# Altium project ActuatorBoard.PrjPcb
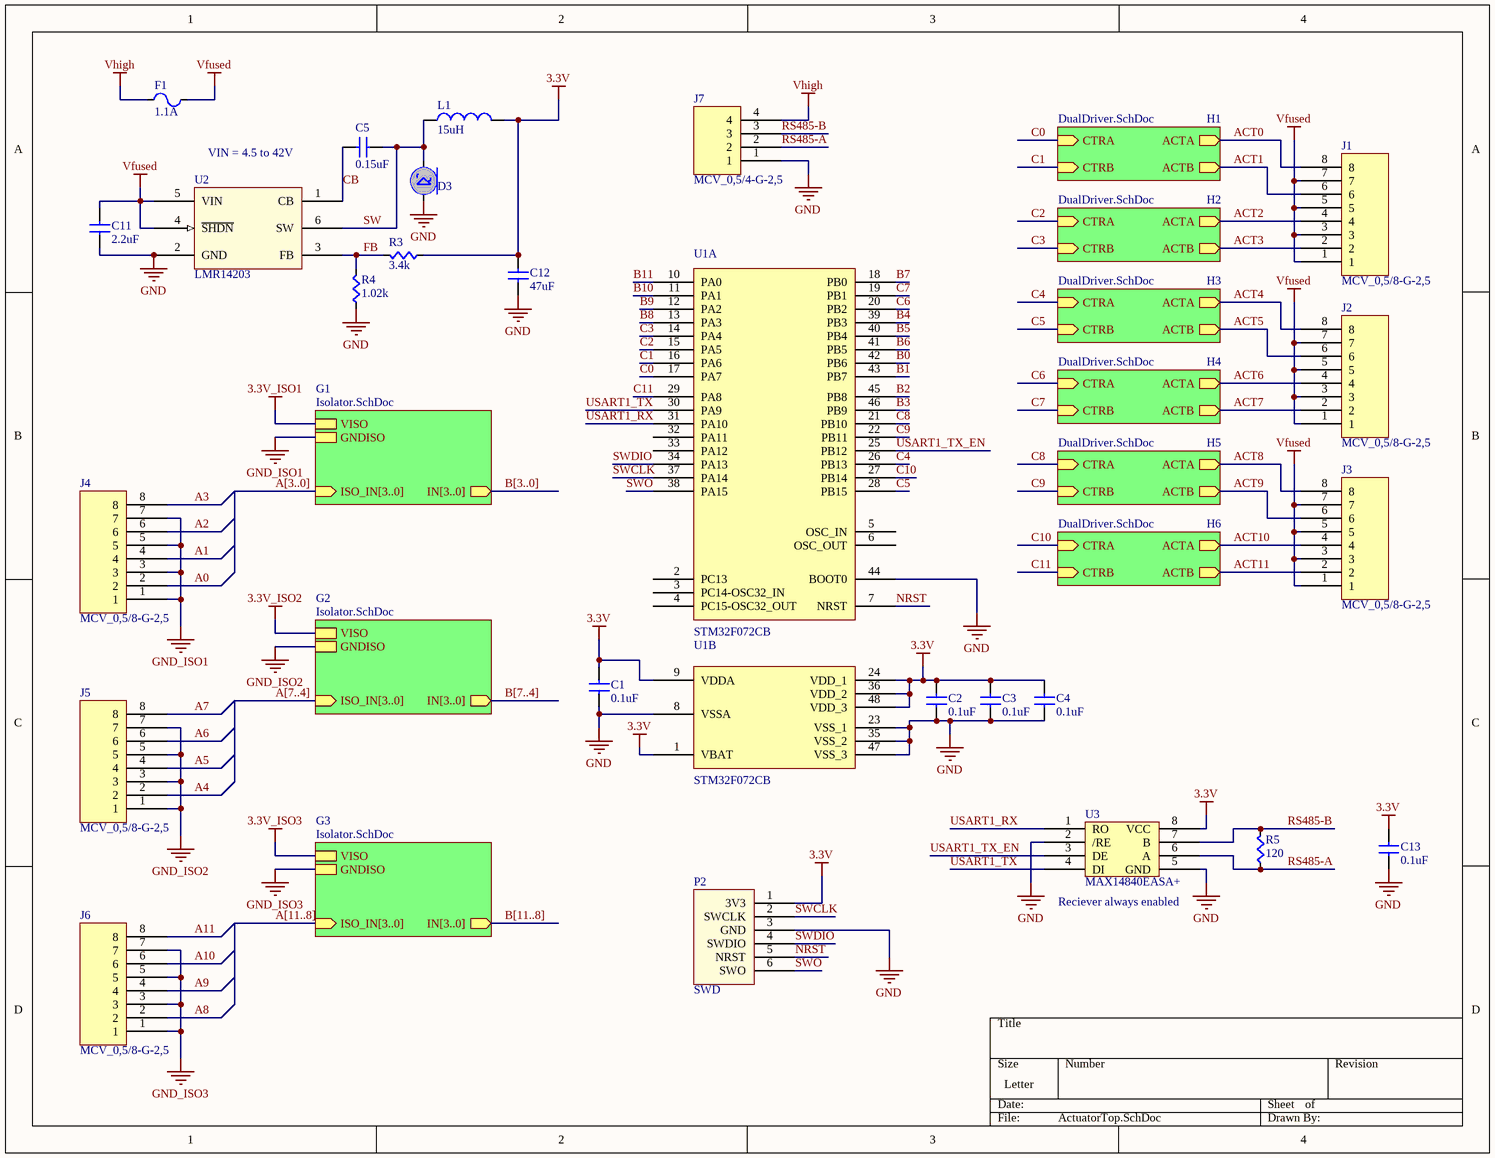
[diagram p0: ActuatorTop.SchDoc]
3 sheets, 85 parts. Net scope: hierarchical (ports join the sheet entries above them; power ports are global).
Board file: ActuatorBoard.PcbDoc
Sheets:
  ActuatorTop.SchDoc
    H1 = DualDriver.SchDoc
    H2 = DualDriver.SchDoc
    H3 = DualDriver.SchDoc
    H4 = DualDriver.SchDoc
    H5 = DualDriver.SchDoc
    H6 = DualDriver.SchDoc
    G1 = Isolator.SchDoc
    G2 = Isolator.SchDoc
    G3 = Isolator.SchDoc

## Sheet ActuatorTop.SchDoc
size Letter

### Parts
C1  value 0.1uF  [CAPC0603]  (hidden comment: Cap)
C2  value 0.1uF  [CAPC0603]  (hidden comment: Cap)
C3  value 0.1uF  [CAPC0603]  (hidden comment: Cap)
C4  value 0.1uF  [CAPC0603]  (hidden comment: Cap)
C5  value 0.15uF  [CAPC0603]  (hidden comment: Cap)
C11  value 2.2uF  [CAPC0805]  (hidden comment: Cap)
C12  value 47uF  [CAPC1206]  (hidden comment: Cap)
C13  value 0.1uF  [CAPC0603]  (hidden comment: Cap)
D3  Schottky  [1N5819HW-7-F]  (value not drawn)
F1  value 1.1A  [PTC7451X11N]  (hidden comment: PTC Fuse)
J1  MCV_0,5/8-G-2,5  [MCV_0,5/8-G-2,5]
J2  MCV_0,5/8-G-2,5  [MCV_0,5/8-G-2,5]
J3  MCV_0,5/8-G-2,5  [MCV_0,5/8-G-2,5]
J4  MCV_0,5/8-G-2,5  [MCV_0,5/8-G-2,5]
J5  MCV_0,5/8-G-2,5  [MCV_0,5/8-G-2,5]
J6  MCV_0,5/8-G-2,5  [MCV_0,5/8-G-2,5]
J7  MCV_0,5/4-G-2,5  [MCV_0,5/4-G-2,5]
L1  Inductance: 15uH  [INDP6060X48N]  (hidden comment: Inductor)
P2  SWD  [SWD_STM32]
R3  value 3.4k  [RES0603]  (hidden comment: Res)
R4  value 1.02k  [RES0603]  (hidden comment: Res)
R5  value 120  [RES0603]  (hidden comment: Res)
U1  STM32F072CB  [STM32F072CB]  (parts A,B of 2)
U2  LMR14203  [SOT95P280X110-6N]
U3  MAX14840EASA+  [MAX14840EASA+]

### Sub-sheets
G1 = Isolator.SchDoc: GNDISO, VISO, ISO_IN[3..0] (in), IN[3..0] (out)
G2 = Isolator.SchDoc: GNDISO, VISO, ISO_IN[3..0] (in), IN[3..0] (out)
G3 = Isolator.SchDoc: GNDISO, VISO, ISO_IN[3..0] (in), IN[3..0] (out)
H1 = DualDriver.SchDoc: ACTA (out), CTRA (in), ACTB (out), CTRB (in)
H2 = DualDriver.SchDoc: ACTA (out), CTRA (in), ACTB (out), CTRB (in)
H3 = DualDriver.SchDoc: ACTA (out), CTRA (in), ACTB (out), CTRB (in)
H4 = DualDriver.SchDoc: ACTA (out), CTRA (in), ACTB (out), CTRB (in)
H5 = DualDriver.SchDoc: ACTA (out), CTRA (in), ACTB (out), CTRB (in)
H6 = DualDriver.SchDoc: ACTA (out), CTRA (in), ACTB (out), CTRB (in)

### Nets
3.3V: C1.1(A) C2.1(A) C3.1(A) C4.1(A) C12.2(B) C13.1(A) L1.2(B) P2.1(3V3) R3.2(B) U1.1(VBAT) U1.9(VDDA) U1.24(VDD_1) U1.36(VDD_2) U1.48(VDD_3) U3.8(VCC)
GND: C1.2(B) C2.2(B) C3.2(B) C4.2(B) C11.1(A) C12.1(A) C13.2(B) D3.A J7.1 P2.3(GND) R4.2(B) U1.8(VSSA) U1.23(VSS_1) U1.35(VSS_2) U1.44(BOOT0) U1.47(VSS_3) U2.2(GND) U3.2(/RE) U3.5(GND)
GND_ISO1: J4.1 J4.3 J4.5 J4.7 ; sheet G1/GNDISO  [project net GNDISO]
GND_ISO2: J5.1 J5.3 J5.5 J5.7 ; sheet G2/GNDISO  [project net GNDISO]
GND_ISO3: J6.1 J6.3 J6.5 J6.7 ; sheet G3/GNDISO  [project net GNDISO]
Vfused: C11.2(B) F1.2(B) J1.1 J1.3 J1.5 J1.7 J2.1 J2.3 J2.5 J2.7 J3.1 J3.3 J3.5 J3.7 U2.4(~{SHDN}) U2.5(VIN)
Vhigh: F1.1(A) J7.4
A0: J4.2
A1: J4.4
A2: J4.6
A3: J4.8
A4: J5.2
A5: J5.4
A6: J5.6
A7: J5.8
A8: J6.2
A9: J6.4
A10: J6.6
A11: J6.8
ACT0: J1.8 ; sheet H1/ACTA
ACT1: J1.6 ; sheet H1/ACTB
ACT2: J1.4 ; sheet H2/ACTA
ACT3: J1.2 ; sheet H2/ACTB
ACT4: J2.8 ; sheet H3/ACTA
ACT5: J2.6 ; sheet H3/ACTB
ACT6: J2.4 ; sheet H4/ACTA
ACT7: J2.2 ; sheet H4/ACTB
ACT8: J3.8 ; sheet H5/ACTA
ACT9: J3.6 ; sheet H5/ACTB
ACT10: J3.4 ; sheet H6/ACTA
ACT11: J3.2 ; sheet H6/ACTB
B0: U1.42(PB6)
B1: U1.43(PB7)
B2: U1.45(PB8)
B3: U1.46(PB9)
B4: U1.39(PB3)
B5: U1.40(PB4)
B6: U1.41(PB5)
B7: U1.18(PB0)
B8: U1.13(PA3)
B9: U1.12(PA2)
B10: U1.11(PA1)
B11: U1.10(PA0)
C0: U1.17(PA7) ; sheet H1/CTRA
C1: U1.16(PA6) ; sheet H1/CTRB
C2: U1.15(PA5) ; sheet H2/CTRA
C3: U1.14(PA4) ; sheet H2/CTRB
C4: U1.26(PB13) ; sheet H3/CTRA
C5: U1.28(PB15) ; sheet H3/CTRB
C6: U1.20(PB2) ; sheet H4/CTRA
C7: U1.19(PB1) ; sheet H4/CTRB
C8: U1.21(PB10) ; sheet H5/CTRA
C9: U1.22(PB11) ; sheet H5/CTRB
C10: U1.27(PB14) ; sheet H6/CTRA
C11: U1.29(PA8) ; sheet H6/CTRB
CB: C5.1(A) U2.1(CB)
FB: R3.1(A) R4.1(A) U2.3(FB)
NRST: P2.5(NRST) U1.7(NRST)
RS485-A: J7.2 R5.2(B) U3.6(A)
RS485-B: J7.3 R5.1(A) U3.7(B)
SW: C5.2(B) D3.C L1.1(A) U2.6(SW)
SWCLK: P2.2(SWCLK) U1.37(PA14)
SWDIO: P2.4(SWDIO) U1.34(PA13)
SWO: P2.6(SWO) U1.38(PA15)
USART1_RX: U1.31(PA10) U3.1(RO)
USART1_TX: U1.30(PA9) U3.4(DI)
USART1_TX_EN: U1.25(PB12) U3.3(DE)

Not connected (* = marked no-connect by the designer): U1 2(PC13) 3(PC14-OSC32_IN) 4(PC15-OSC32_OUT) 5(OSC_IN) 6(OSC_OUT) 32(PA11) 33(PA12)

### Buses and harness runs
bus A[3..0] = sheet G1/ISO_IN[3..0]
bus A[7..4] = sheet G2/ISO_IN[3..0]
bus A[11..8] = sheet G3/ISO_IN[3..0]
bus B[3..0] = sheet G1/IN[3..0]
bus B[7..4] = sheet G2/IN[3..0]
bus B[11..8] = sheet G3/IN[3..0]

### Notes on the sheet
- VIN = 4.5 to 42V
- (near U3) Reciever always enabled

### Library data of the parts
D3 = Schottky: Schottky Diode Template; Supplier Part Number 1: 1N5819HW-FDICT-ND; Supplier 1: Digi-Key
F1 = PTC_Fuse: Supplier 1: Digi-Key; Supplier Part Number 1: 507-1744-1-ND
J1-J6 = MCV_0,5/8-G-2,5: CONN TERM BLOCK 2.50MM 8POS, Vertical, Through-Hole, 4A; Supplier 1: Digi-Key; Supplier Part Number 1: 277-1458-ND; Mating Conn. Digi-Key P/N: 277-1436-ND
J7 = MCV_0,5/4-G-2,5: CONN TERM BLOCK 2.50MM 4POS, Vertical, Through-Hole, 4A; Supplier 1: Digi-Key; Supplier Part Number 1: 277-1454-ND; Mating Conn. Digi-Key P/N: 277-1432-ND
P2 = SWD_STM32: SWD connector matching the pinout on STM Discovery Boards; Supplier 1: Digi-Key
U1 = STM32F072CB: MCU 32BIT 128KB FLASH 48LQFP; Supplier 1: Digi-Key; Supplier Part Number 1: 497-14645-ND
U2 = LMR14203: Simple Switcher 42Vin 0.3A Step-Down Voltage Regulator; Supplier 1: Digi-Key; Supplier Part Number 1: LMR14203XMKE/NOPBCT-ND
U3 = MAX14840EASA+: TXRX 40MBPS RS485/RS422 8-SOIC; Supplier 1: Digi-Key; Supplier Part Number 1: MAX14840EASA+-ND
C1-C5 C11-C13 = Cap: Supplier 1: Digi-Key
  C1-C4 C13: Supplier Part Number 1: 445-1314-1-ND
  C5: Supplier Part Number 1: 445-13339-1-ND
  C11: Supplier Part Number 1: 445-5968-1-ND
  C12: Supplier Part Number 1: 399-5508-1-ND
L1 = Inductor: Supplier 1: Digi-Key; Supplier Part Number 1: 445-4574-1-ND
R3-R5 = Res: Supplier 1: Digi-Key
  R3: Supplier Part Number 1: 311-3.40KHRCT-ND
  R4: Supplier Part Number 1: 311-1.02KHRCT-ND
  R5: Supplier Part Number 1: 311-120HRCT-ND

## Sheet DualDriver.SchDoc
size Letter
Used 6 times, as channels H1, H2, H3, H4, H5, H6. Parts and nets are listed once, with the designators drawn on the sheet.
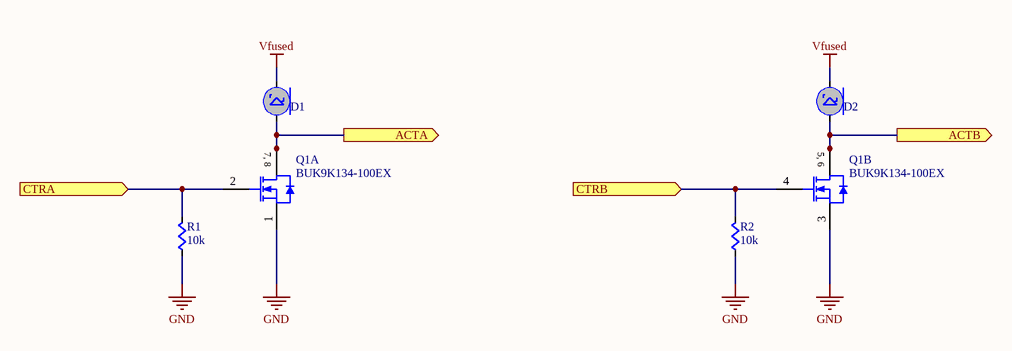
[diagram p1: DualDriver.SchDoc]

### Parts
D1  Schottky  [SS110-TP]  (value not drawn)
D2  Schottky  [SS110-TP]  (value not drawn)
Q1  BUK9K134-100EX  [NXP_SOT1205]  (parts A,B of 2)
R1  value 10k  [RES0603]  (hidden comment: Res)
R2  value 10k  [RES0603]  (hidden comment: Res)

### Ports
ACTA (out), ACTB (out), CTRA (in), CTRB (in)

### Nets
GND: Q1.1(S) Q1.3(S) R1.2(B) R2.2(B)
Vfused: D1.C D2.C
ACTA: D1.A Q1.7(D) Q1.8(D) ; port ACTA
ACTB: D2.A Q1.5(D) Q1.6(D) ; port ACTB
CTRA: Q1.2(G) R1.1(A) ; port CTRA
CTRB: Q1.4(G) R2.1(A) ; port CTRB

### Channels
H1: designators end in _H1; ports ACTA=ACT0 ACTB=ACT1 CTRA=C0 CTRB=C1
H2: designators end in _H2; ports ACTA=ACT2 ACTB=ACT3 CTRA=C2 CTRB=C3
H3: designators end in _H3; ports ACTA=ACT4 ACTB=ACT5 CTRA=C4 CTRB=C5
H4: designators end in _H4; ports ACTA=ACT6 ACTB=ACT7 CTRA=C6 CTRB=C7
H5: designators end in _H5; ports ACTA=ACT8 ACTB=ACT9 CTRA=C8 CTRB=C9
H6: designators end in _H6; ports ACTA=ACT10 ACTB=ACT11 CTRA=C10 CTRB=C11

### Notes on the sheet
- (in symbol BUK9K134-100EX, part A) 7, 8
- (in symbol BUK9K134-100EX, part B) 5, 6

### Library data of the parts
D1 D2 = Schottky: Schottky Diode Template; Supplier 1: Digi-Key; Supplier Part Number 1: B1100-FDICT-ND
Q1 = BUK9K134-100EX: MOSFET DUAL N-CH 100V 8.5A SOT1205; Supplier 1: Digi-Key; Supplier Part Number 1: 568-11631-1-ND
R1 R2 = Res: Supplier 1: Digi-Key; Supplier Part Number 1: 311-10.0KHRCT-ND

## Sheet Isolator.SchDoc
size A
Used 3 times, as channels G1, G2, G3. Parts and nets are listed once, with the designators drawn on the sheet.
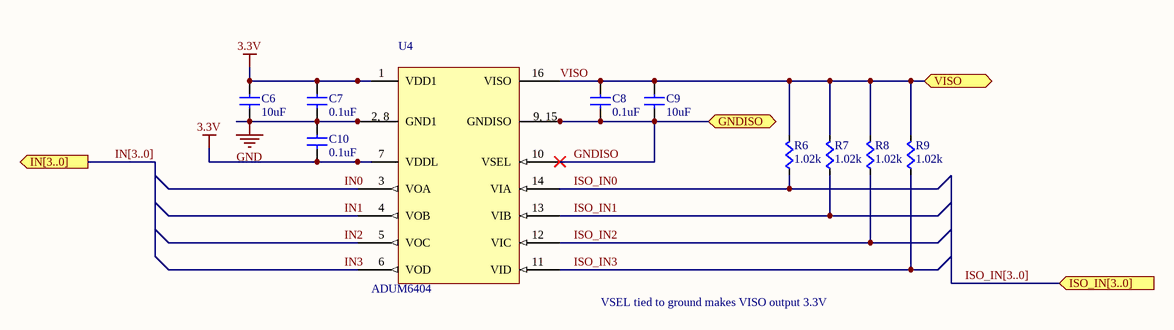
[diagram p2: Isolator.SchDoc]

### Parts
C6  value 10uF  [CAPC0603]  (hidden comment: Cap)
C7  value 0.1uF  [CAPC0603]  (hidden comment: Cap)
C8  value 0.1uF  [CAPC0603]  (hidden comment: Cap)
C9  value 10uF  [CAPC0603]  (hidden comment: Cap)
C10  value 0.1uF  [CAPC0603]  (hidden comment: Cap)
R6  value 1.02k  [RES0603]  (hidden comment: Res)
R7  value 1.02k  [RES0603]  (hidden comment: Res)
R8  value 1.02k  [RES0603]  (hidden comment: Res)
R9  value 1.02k  [RES0603]  (hidden comment: Res)
U4  ADUM6404  [SOIC127P1030X265-16N]

### Ports
GNDISO, IN[3..0] (out), ISO_IN[3..0] (in), VISO

### Nets
3.3V: C6.2(B) C7.2(B) C10.1(A) U4.1(VDD1) U4.7(VDDL)
GND: C6.1(A) C7.1(A) C10.2(B) U4.2(GND1) U4.8(GND1)
GNDISO: C8.1(A) C9.1(A) U4.9(GNDISO) U4.10(VSEL) U4.15(GNDISO) ; port GNDISO
IN0: U4.3(VOA)
IN1: U4.4(VOB)
IN2: U4.5(VOC)
IN3: U4.6(VOD)
ISO_IN0: R6.2(B) U4.14(VIA)
ISO_IN1: R7.2(B) U4.13(VIB)
ISO_IN2: R8.2(B) U4.12(VIC)
ISO_IN3: R9.2(B) U4.11(VID)
VISO: C8.2(B) C9.2(B) R6.1(A) R7.1(A) R8.1(A) R9.1(A) U4.16(VISO) ; port VISO

### Channels
G1: designators end in _G1; ports GNDISO=GNDISO VISO=VISO_G1
G2: designators end in _G2; ports GNDISO=GNDISO VISO=VISO_G2
G3: designators end in _G3; ports GNDISO=GNDISO VISO=VISO_G3

### Buses and harness runs
bus IN[3..0] = port IN[3..0]
bus ISO_IN[3..0] = port ISO_IN[3..0]

### Notes on the sheet
- VSEL tied to ground makes VISO output 3.3V
- (in symbol ADUM6404) 2, 8; 9, 15

### Library data of the parts
U4 = ADUM6404: Digital Isolator, 4 channel, with isolated power; Supplier 1: Digi-Key; Supplier Part Number 1: ADUM6404ARWZ-ND
C6-C10 = Cap: Supplier 1: Digi-Key
  C6 C9: Supplier Part Number 1: 445-4112-1-ND
  C7 C8 C10: Supplier Part Number 1: 445-1314-1-ND
R6-R9 = Res: Supplier 1: Digi-Key; Supplier Part Number 1: 311-1.02KHRCT-ND

## Nets that join several sheets
3.3V: ActuatorTop (15 pins), G1 (5 pins), G2 (5 pins), G3 (5 pins)
GND: ActuatorTop (19 pins), H1 (Q1_H1.1 Q1_H1.3 R1_H1.2 R2_H1.2), H2 (Q1_H2.1 Q1_H2.3 R1_H2.2 R2_H2.2), H3 (Q1_H3.1 Q1_H3.3 R1_H3.2 R2_H3.2), H4 (Q1_H4.1 Q1_H4.3 R1_H4.2 R2_H4.2), H5 (Q1_H5.1 Q1_H5.3 R1_H5.2 R2_H5.2), H6 (Q1_H6.1 Q1_H6.3 R1_H6.2 R2_H6.2), G1 (5 pins), G2 (5 pins), G3 (5 pins)
GNDISO: ActuatorTop (J4.1 J4.3 J4.5 J4.7), G1 (5 pins)
GNDISO: ActuatorTop (J5.1 J5.3 J5.5 J5.7), G2 (5 pins)
GNDISO: ActuatorTop (J6.1 J6.3 J6.5 J6.7), G3 (5 pins)
Vfused: ActuatorTop (16 pins), H1 (D1_H1.C D2_H1.C), H2 (D1_H2.C D2_H2.C), H3 (D1_H3.C D2_H3.C), H4 (D1_H4.C D2_H4.C), H5 (D1_H5.C D2_H5.C), H6 (D1_H6.C D2_H6.C)
A0: ActuatorTop (J4.2), G1 (R6_G1.2 U4_G1.14)
A1: ActuatorTop (J4.4), G1 (R7_G1.2 U4_G1.13)
A2: ActuatorTop (J4.6), G1 (R8_G1.2 U4_G1.12)
A3: ActuatorTop (J4.8), G1 (R9_G1.2 U4_G1.11)
A4: ActuatorTop (J5.2), G2 (R6_G2.2 U4_G2.14)
A5: ActuatorTop (J5.4), G2 (R7_G2.2 U4_G2.13)
A6: ActuatorTop (J5.6), G2 (R8_G2.2 U4_G2.12)
A7: ActuatorTop (J5.8), G2 (R9_G2.2 U4_G2.11)
A8: ActuatorTop (J6.2), G3 (R6_G3.2 U4_G3.14)
A9: ActuatorTop (J6.4), G3 (R7_G3.2 U4_G3.13)
A10: ActuatorTop (J6.6), G3 (R8_G3.2 U4_G3.12)
A11: ActuatorTop (J6.8), G3 (R9_G3.2 U4_G3.11)
ACT0: ActuatorTop (J1.8), H1 (D1_H1.A Q1_H1.7 Q1_H1.8)
ACT1: ActuatorTop (J1.6), H1 (D2_H1.A Q1_H1.5 Q1_H1.6)
ACT2: ActuatorTop (J1.4), H2 (D1_H2.A Q1_H2.7 Q1_H2.8)
ACT3: ActuatorTop (J1.2), H2 (D2_H2.A Q1_H2.5 Q1_H2.6)
ACT4: ActuatorTop (J2.8), H3 (D1_H3.A Q1_H3.7 Q1_H3.8)
ACT5: ActuatorTop (J2.6), H3 (D2_H3.A Q1_H3.5 Q1_H3.6)
ACT6: ActuatorTop (J2.4), H4 (D1_H4.A Q1_H4.7 Q1_H4.8)
ACT7: ActuatorTop (J2.2), H4 (D2_H4.A Q1_H4.5 Q1_H4.6)
ACT8: ActuatorTop (J3.8), H5 (D1_H5.A Q1_H5.7 Q1_H5.8)
ACT9: ActuatorTop (J3.6), H5 (D2_H5.A Q1_H5.5 Q1_H5.6)
ACT10: ActuatorTop (J3.4), H6 (D1_H6.A Q1_H6.7 Q1_H6.8)
ACT11: ActuatorTop (J3.2), H6 (D2_H6.A Q1_H6.5 Q1_H6.6)
B0: ActuatorTop (U1.42), G1 (U4_G1.3)
B1: ActuatorTop (U1.43), G1 (U4_G1.4)
B2: ActuatorTop (U1.45), G1 (U4_G1.5)
B3: ActuatorTop (U1.46), G1 (U4_G1.6)
B4: ActuatorTop (U1.39), G2 (U4_G2.3)
B5: ActuatorTop (U1.40), G2 (U4_G2.4)
B6: ActuatorTop (U1.41), G2 (U4_G2.5)
B7: ActuatorTop (U1.18), G2 (U4_G2.6)
B8: ActuatorTop (U1.13), G3 (U4_G3.3)
B9: ActuatorTop (U1.12), G3 (U4_G3.4)
B10: ActuatorTop (U1.11), G3 (U4_G3.5)
B11: ActuatorTop (U1.10), G3 (U4_G3.6)
C0: ActuatorTop (U1.17), H1 (Q1_H1.2 R1_H1.1)
C1: ActuatorTop (U1.16), H1 (Q1_H1.4 R2_H1.1)
C2: ActuatorTop (U1.15), H2 (Q1_H2.2 R1_H2.1)
C3: ActuatorTop (U1.14), H2 (Q1_H2.4 R2_H2.1)
C4: ActuatorTop (U1.26), H3 (Q1_H3.2 R1_H3.1)
C5: ActuatorTop (U1.28), H3 (Q1_H3.4 R2_H3.1)
C6: ActuatorTop (U1.20), H4 (Q1_H4.2 R1_H4.1)
C7: ActuatorTop (U1.19), H4 (Q1_H4.4 R2_H4.1)
C8: ActuatorTop (U1.21), H5 (Q1_H5.2 R1_H5.1)
C9: ActuatorTop (U1.22), H5 (Q1_H5.4 R2_H5.1)
C10: ActuatorTop (U1.27), H6 (Q1_H6.2 R1_H6.1)
C11: ActuatorTop (U1.29), H6 (Q1_H6.4 R2_H6.1)